# EAGLE design Input (EAGLE 7.2.0)
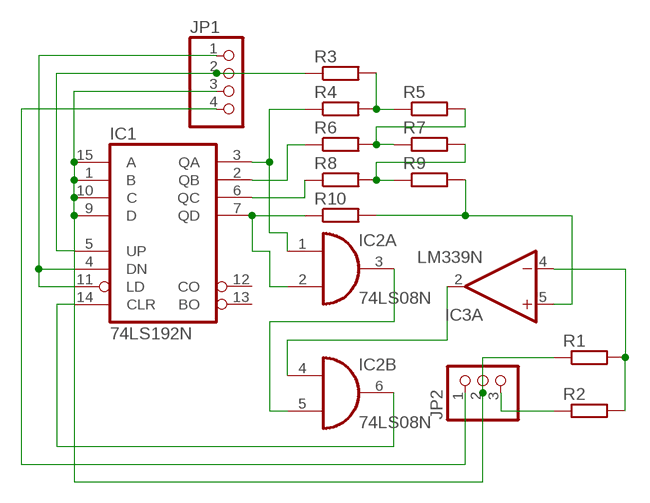
[diagram p0: schematic, sheet 1]

## Parts
IC1  74LS192N  [DIL16]
IC2  74LS08N  [DIL14]
IC3  LM339N  [DIL14]
JP1  PINHD-1X4  [1X04]
JP2  PINHD-1X3  [1X03]
R1  R-EU_0207/10  [0207/10]
R2  R-EU_0207/10  [0207/10]
R3  R-EU_0207/10  [0207/10]
R4  R-EU_0207/10  [0207/10]
R5  R-EU_0207/10  [0207/10]
R6  R-EU_0207/10  [0207/10]
R7  R-EU_0207/10  [0207/10]
R8  R-EU_0207/10  [0207/10]
R9  R-EU_0207/10  [0207/10]
R10  R-EU_0207/10  [0207/10]

## Nets
N$1: IC3.5(A:+IN) R9.2 R10.2
N$2: IC1.3(QA) IC2.1(A:I0) R4.1
N$3: IC2.3(A:O) IC2.5(B:I1)
N$4: IC1.14(CLR) IC2.6(B:O)
N$5: IC1.5(UP) JP1.2 R3.1
N$6: IC1.4(DN) IC1.11(LD) JP1.1
N$7: IC1.1(B) IC1.9(D) IC1.10(C) IC1.15(A) JP1.3 JP2.2 R1.1
N$8: IC2.4(B:I0) IC3.2(A:OUT)
N$9: IC3.4(A:-IN) R1.2 R2.2
N$11: JP2.3 R2.1
N$12: JP1.4 JP2.1
N$14: R7.2 R8.2 R9.1
N$15: R5.2 R6.2 R7.1
N$16: R3.2 R4.2 R5.1
N$17: IC1.6(QC) R8.1
N$18: IC1.2(QB) R6.1
N$20: IC1.7(QD) IC2.2(A:I1) R10.1
Unconnected: IC1.12(CO) IC1.13(BO) IC2.8(C:O) IC2.9(C:I0) IC2.10(C:I1) IC2.11(D:O) IC2.12(D:I0) IC2.13(D:I1) IC3.1(B:OUT) IC3.6(B:-IN) IC3.7(B:+IN) IC3.8(C:-IN) IC3.9(C:+IN) IC3.10(D:-IN) IC3.11(D:+IN) IC3.13(D:OUT) IC3.14(C:OUT)

## Power pins joined to a net without a drawn wire
GND: IC1.8(GND) IC2.7(P:GND) IC3.12(P:GND)
V+: IC3.3(P:V+)
VCC: IC1.16(VCC) IC2.14(P:VCC)

## Library data of the parts
IC1 = 74xx-us:74*192: Synchronous 4-bit UP/DOWN COUNTER
IC2 = 74xx-eu:74*08: Quad 2-input AND gate
IC3 = linear:LM339: Low Power Low Offset Voltage Quad Comparators with open collector; LM139/LM239/LM339/LM2901/LM3302
JP1 = pinhead:PINHD-1X4: PIN HEADER
JP2 = pinhead:PINHD-1X3: PIN HEADER
R1-R10 = rcl:R-EU_: RESISTOR, European symbol

## Board
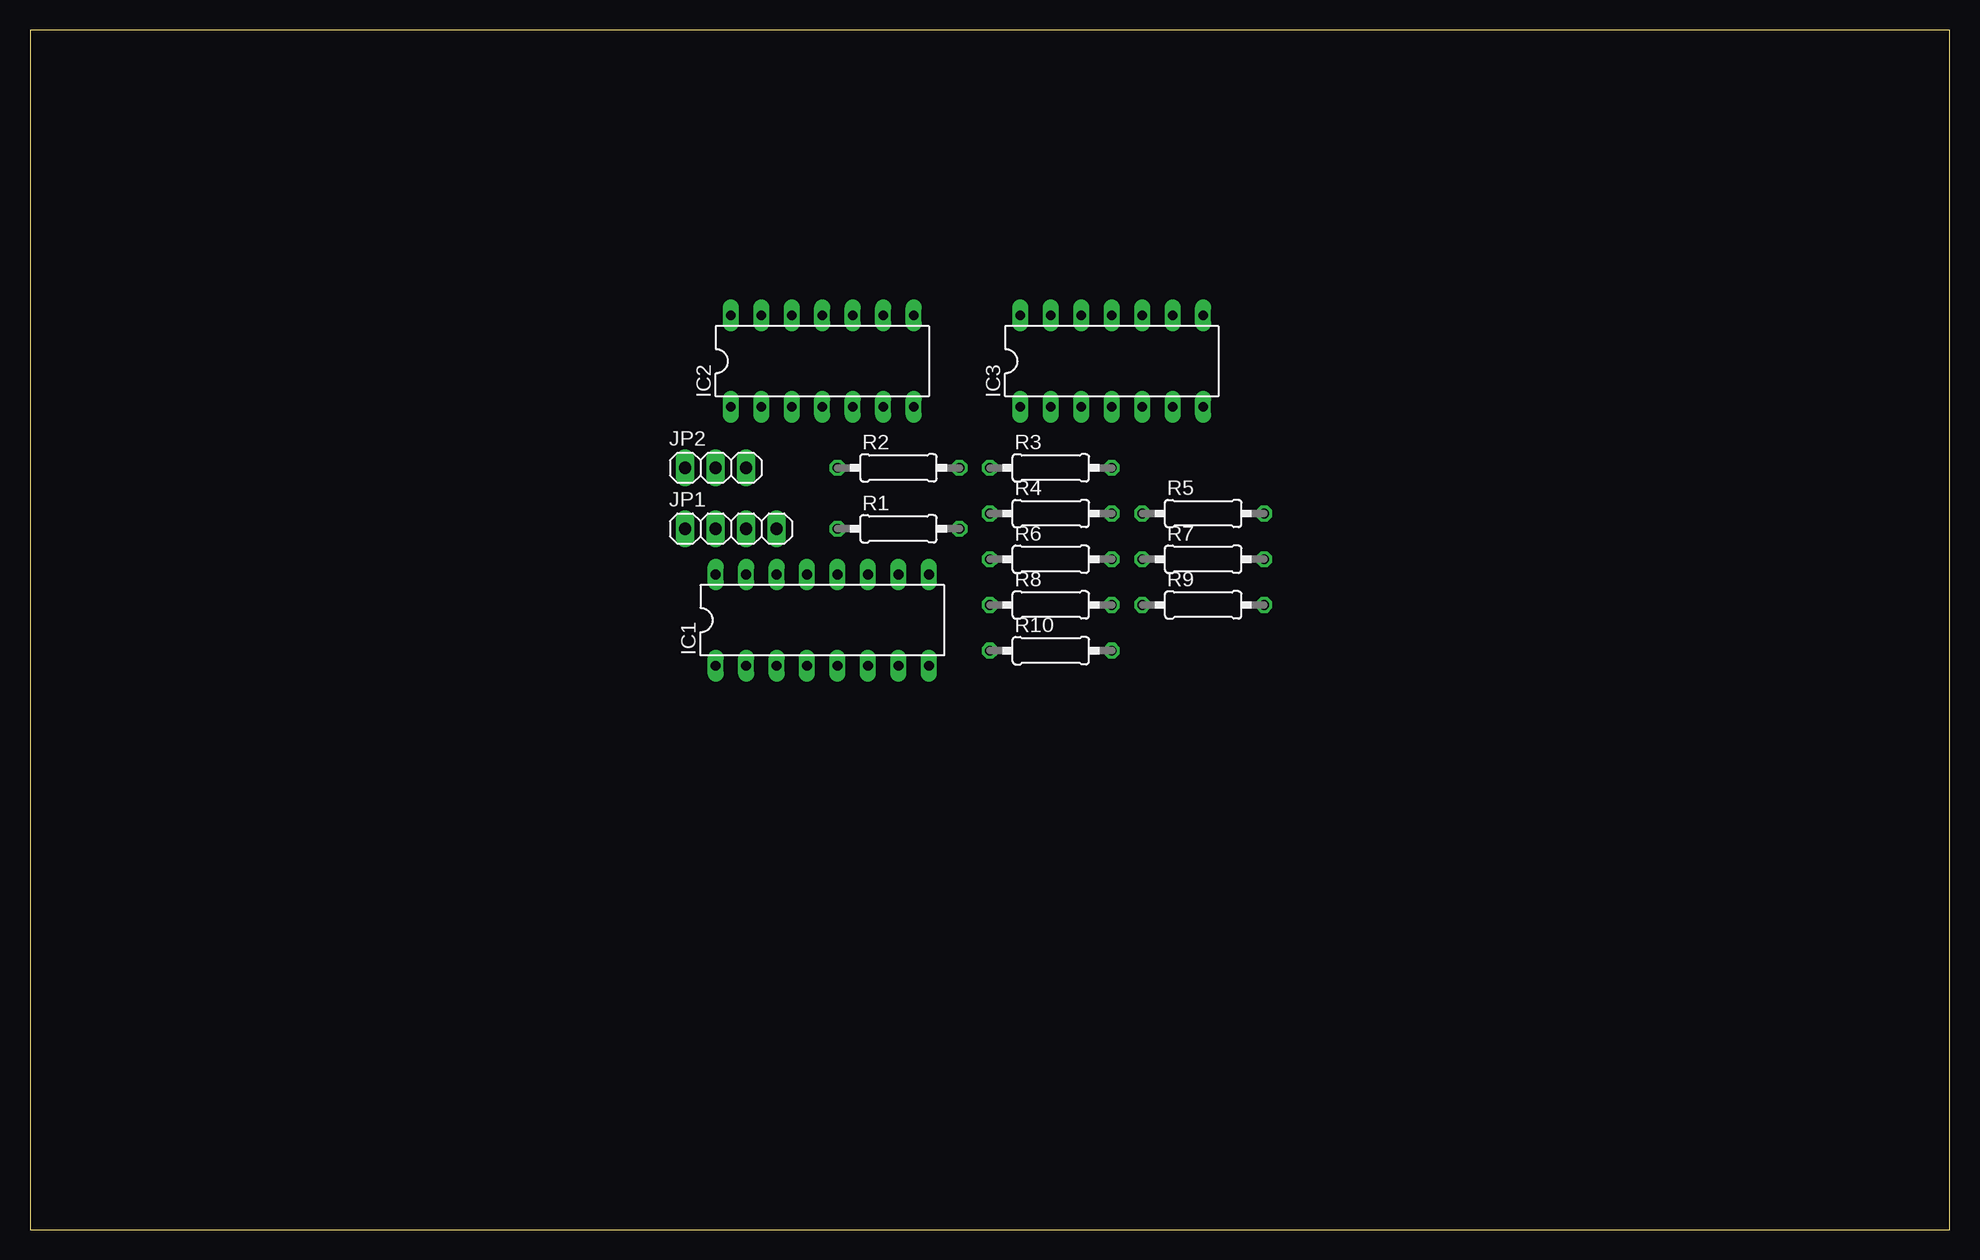
[diagram p1: board, top side]
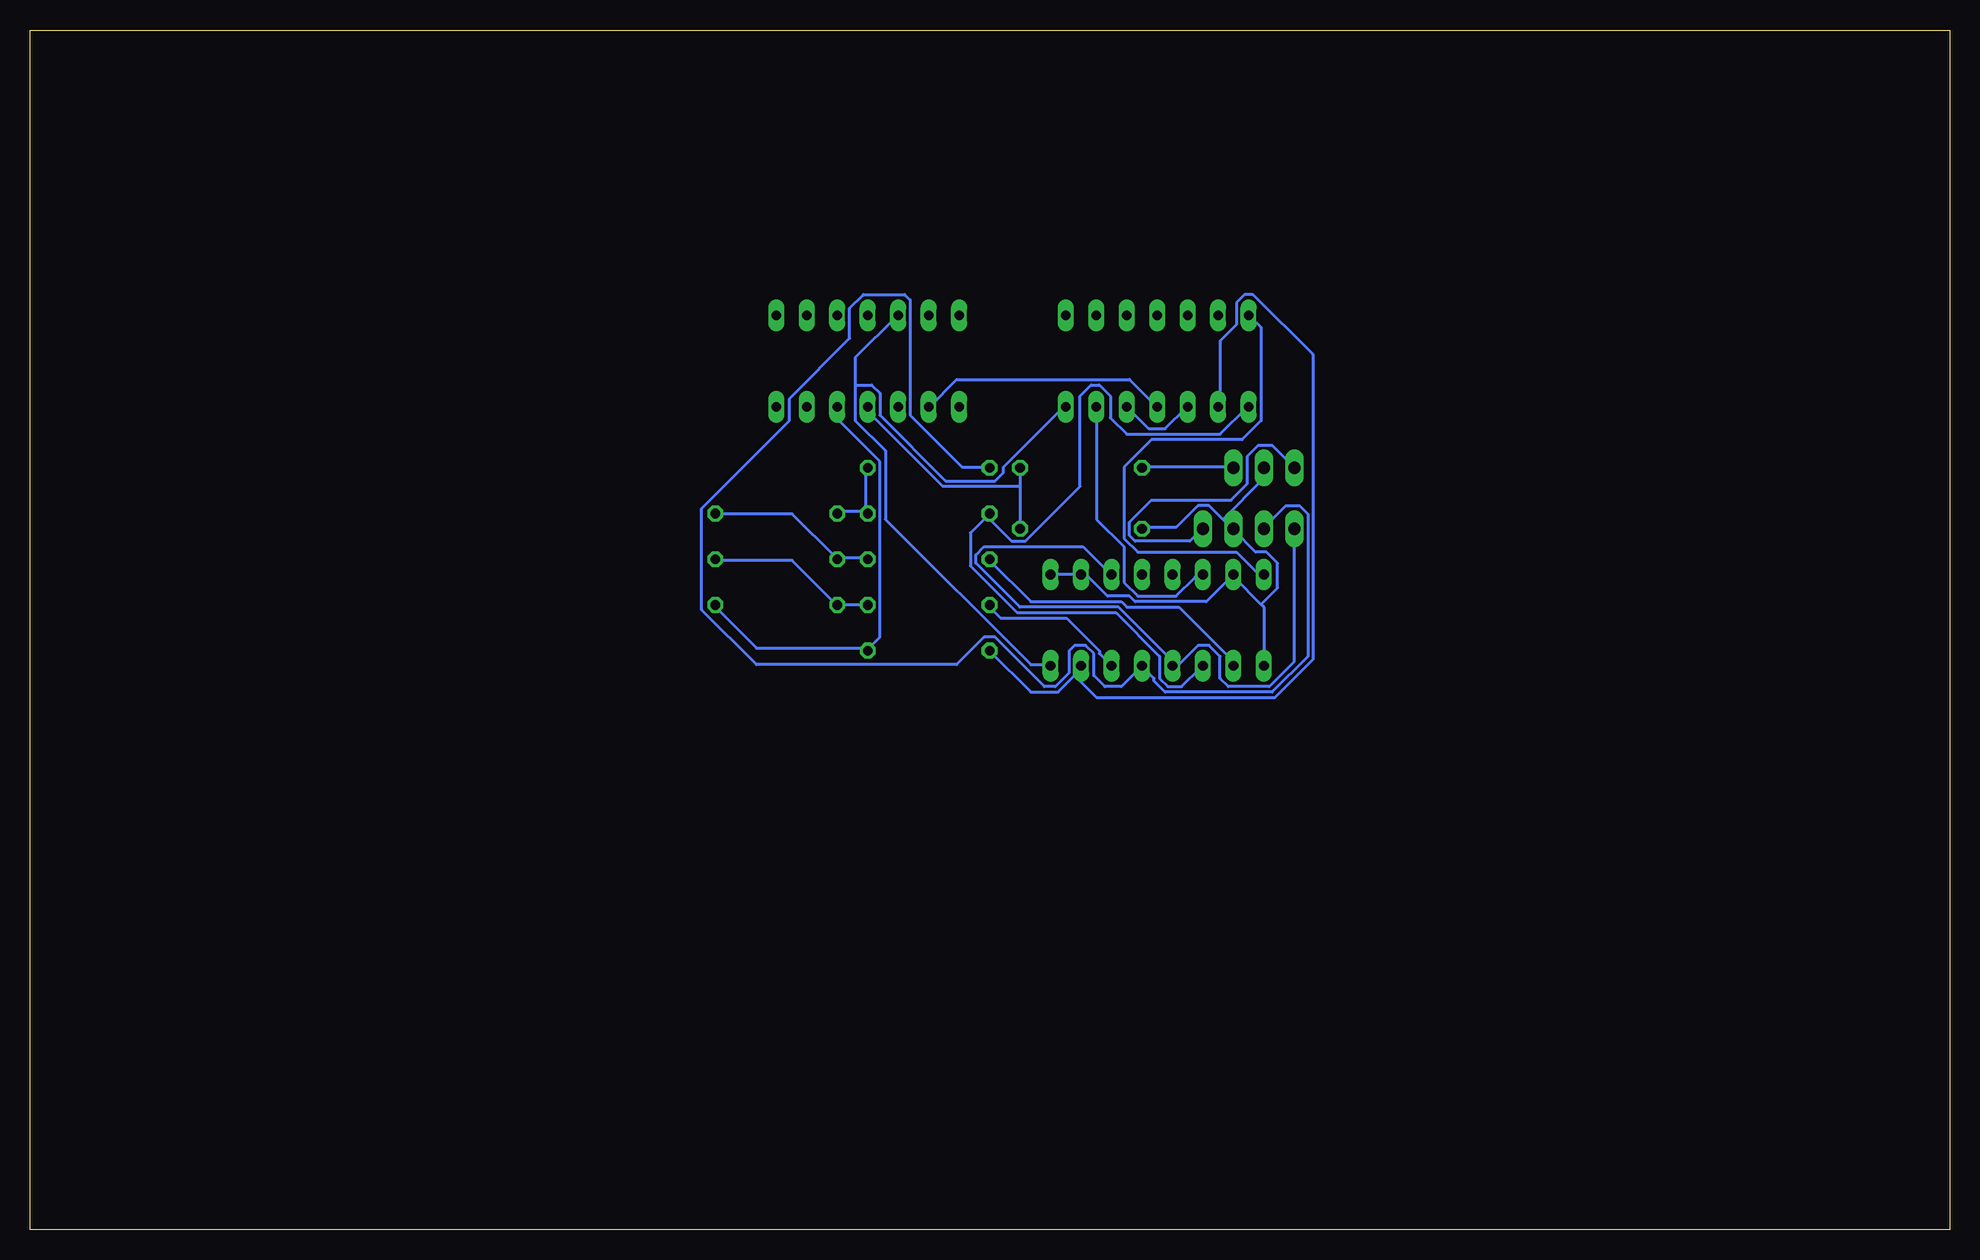
[diagram p2: board, bottom side, seen from below]

Size 160 x 100 mm. Coordinates in mm from the lower left corner, seen from the top.
Outline: 0,0 160,0 160,100 0,100 0,0
Copper layers (1*16): Top 0.035mm / dielectric 1.5mm / Bottom 0.035mm
Design rules "default": minimum track width 10mil, minimum drill 24mil, track to track 8mil, track to pad 8mil, pad to pad 8mil, via to via 8mil, smd to smd 8mil, copper to edge 40mil, drill to drill 8mil, minimum pad ring 10mil, minimum via ring 8mil, stop-mask expansion 4mil, vias tented up to drill 0mil, thermal gap 10mil

### Footprints (pad centres in the part's own frame; a part is rotated, then mirrored left to right if it is on the bottom)
DIL16 = drill 0.813 long: 1 -8.89,-3.81; 2 -6.35,-3.81; 3 -3.81,-3.81; 4 -1.27,-3.81; 5 1.27,-3.81; 6 3.81,-3.81; 7 6.35,-3.81; 8 8.89,-3.81; 9 8.89,3.81; 10 6.35,3.81; 11 3.81,3.81; 12 1.27,3.81; 13 -1.27,3.81; 14 -3.81,3.81; 15 -6.35,3.81; 16 -8.89,3.81
DIL14 = drill 0.813 long: 1 -7.62,-3.81; 2 -5.08,-3.81; 3 -2.54,-3.81; 4 0,-3.81; 5 2.54,-3.81; 6 5.08,-3.81; 7 7.62,-3.81; 8 7.62,3.81; 9 5.08,3.81; 10 2.54,3.81; 11 0,3.81; 12 -2.54,3.81; 13 -5.08,3.81; 14 -7.62,3.81
1X04 = drill 1.016 long: 1 -3.81,0; 2 -1.27,0; 3 1.27,0; 4 3.81,0
1X03 = drill 1.016 long: 1 -2.54,0; 2 0,0; 3 2.54,0
0207/10 = drill 0.813 octagon: 1 -5.08,0; 2 5.08,0

### Placement (x,y rotation side)
IC1  66.04,50.8 0 top
IC2  66.04,72.39 0 top
IC3  90.17,72.39 0 top
JP1  58.42,58.42 0 top
JP2  57.15,63.5 0 top
R1  72.39,58.42 0 top
R2  72.39,63.5 0 top
R3  85.09,63.5 0 top
R4  85.09,59.69 0 top
R5  97.79,59.69 0 top
R6  85.09,55.88 0 top
R7  97.79,55.88 0 top
R8  85.09,52.07 0 top
R9  97.79,52.07 0 top
R10  85.09,48.26 0 top

### Tracks (layer width: path | path; a pad name or v marks a point on that pad's centre or on a via)
GND
  Bottom 0.254: 91.21,70.41 91.21,72.69 87.78,76.12 IC3.12 | 91.21,70.41 91.21,67.44 88.7,64.92 88.7,59.21 76.58,47.09 74.98,47.09 IC1.8 | 91.21,70.41 89.84,70.41 89.15,69.72 89.15,67.89 83.67,62.41 79.55,62.41 78.87,63.09 78.87,63.55 73.84,68.58 IC2.7
N$1
  Bottom 0.254: R9.2 102.87,51.89 99.44,48.46 90.3,48.46 R10.2 90.07,48.46 89.15,49.38 89.15,64.01 92.58,67.44 92.58,68.58 IC3.5
N$2
  Bottom 0.254: 80.24,59.44 80.01,59.66 R4.1 80.24,59.44 | 80.24,59.44 81.61,58.06 81.61,55.32 77.72,51.44 69.49,51.44 65.84,47.78 65.84,45.95 65.15,45.26 64.01,45.26 62.41,46.86 IC1.3 | 80.24,59.44 78.18,57.38 77.04,57.38 72.47,61.95 72.47,69.49 71.55,70.41 70.87,70.41 69.95,69.49 69.95,67.67 68.58,66.29 60.81,66.29 58.52,68.58 IC2.1
N$3
  Bottom 0.254: IC2.5 66.75,66.75 65.38,66.75 63.55,68.58 IC2.3
N$4
  Bottom 0.254: IC1.14 62.41,54.41 62.87,54.41 64.47,52.81 67.67,52.81 68.81,53.95 68.81,56.92 71.09,59.21 71.09,68.58 IC2.6
N$5
  Bottom 0.254: JP1.2 57.15,58.52 55.32,60.35 54.18,60.35 53.49,59.66 53.49,47.78 56.46,44.81 65.38,44.81 66.29,45.72 66.29,45.95 67.21,46.86 IC1.5 69.04,45.26 70.41,45.26 71.32,46.18 71.32,48.01 72.01,48.69 72.92,48.69 73.38,48.23 73.38,46.41 74.52,45.26 75.44,45.26 79.55,49.38 80.47,49.38 82.75,47.09 99.44,47.09 104.01,51.66 104.01,60.12 96.7,67.44 96.7,69.27 91.67,74.3 91.67,76.81 90.53,77.95 87.1,77.95 86.64,77.5 86.64,67.89 82.3,63.55 80.01,63.55 R3.1
N$6
  Bottom 0.254: 64.47,47.09 64.24,47.09 62.64,48.69 61.72,48.69 60.81,47.78 60.81,45.95 60.12,45.26 56.69,45.26 54.63,47.32 54.63,58.29 JP1.1 | 64.47,47.09 64.69,47.09 IC1.4 64.47,47.09 | 64.47,47.09 69.27,51.89 77.5,51.89 81.15,55.55 81.15,56.24 80.47,56.92 72.24,56.92 69.95,54.63 IC1.11
N$7
  Bottom 0.254: 60.58,59.21 59.89,58.52 JP1.3 59.66,58.29 57.84,56.46 56.92,56.46 56.01,55.55 56.01,53.49 57.38,52.12 | 60.58,59.21 61.72,60.35 62.64,60.35 64.47,58.52 67.21,58.52 R1.1 | JP2.2 57.15,62.64 60.58,59.21 | IC1.9 74.75,54.63 72.47,54.63 IC1.10 72.24,54.41 71.78,54.41 70.18,52.81 68.35,52.81 67.89,52.35 61.95,52.35 IC1.15 59.66,54.41 57.38,52.12 | IC1.1 57.15,51.89 57.38,52.12
N$8
  Bottom 0.254: IC2.4 66.06,68.58 68.35,70.87 82.75,70.87 85.04,68.58 IC3.2
N$9
  Bottom 0.254: 77.5,61.95 77.5,63.32 R2.2 | 77.5,61.95 77.5,58.52 R1.2 | 77.5,61.95 83.9,61.95 90.07,68.12 90.07,68.58 IC3.4
N$11
  Bottom 0.254: R2.1 67.21,63.55 59.89,63.55 JP2.3
N$12
  Bottom 0.254: JP2.1 54.63,63.55 56.46,65.38 57.61,65.38 58.52,64.47 58.52,62.18 59.89,60.81 66.52,60.81 68.35,58.98 68.35,57.84 67.89,57.38 63.32,57.38 62.41,58.29 JP1.4
N$14
  Bottom 0.254: R8.2 90.3,52.12 92.58,52.12 R9.1 92.81,52.12 96.47,55.78 102.87,55.78 R7.2
N$15
  Bottom 0.254: R6.2 90.3,56.01 92.58,56.01 R7.1 92.81,56.01 96.47,59.66 102.87,59.66 R5.2
N$16
  Bottom 0.254: 90.3,59.89 92.58,59.89 R5.1 | 90.3,59.89 90.3,63.32 R3.2 | 90.3,59.89 R4.2
N$17
  Bottom 0.254: IC1.6 70.87,48.01 70.87,48.23 73.61,50.98 79.1,50.98 80.01,51.89 R8.1
N$18
  Bottom 0.254: IC1.2 59.89,47.09 59.89,47.55 64.24,51.89 68.58,51.89 69.04,52.35 76.58,52.35 80.01,55.78 R6.1
N$20
  Bottom 0.254: 72.92,46.18 72.92,46.41 72.47,46.86 IC1.7 72.92,46.18 | 72.92,46.18 74.3,44.81 76.58,44.81 80.01,48.23 R10.1 | 72.92,46.18 71.09,44.35 56.24,44.35 53.03,47.55 53.03,72.92 58.06,77.95 58.75,77.95 59.44,77.27 59.44,75.44 60.81,74.07 60.81,68.58 IC2.2
VCC
  Bottom 0.254: IC1.16 57.15,54.63 57.61,54.63 59.44,56.46 67.67,56.46 68.81,57.61 68.81,63.55 66.52,65.84 58.98,65.84 57.38,67.44 57.38,75.21 58.29,76.12 IC2.14